# Altium schematic sheet Madhumathimmiv_8-bit-breadboard-computer-modules__schematic_Register__register.schdoc
size 304 x 180 mm
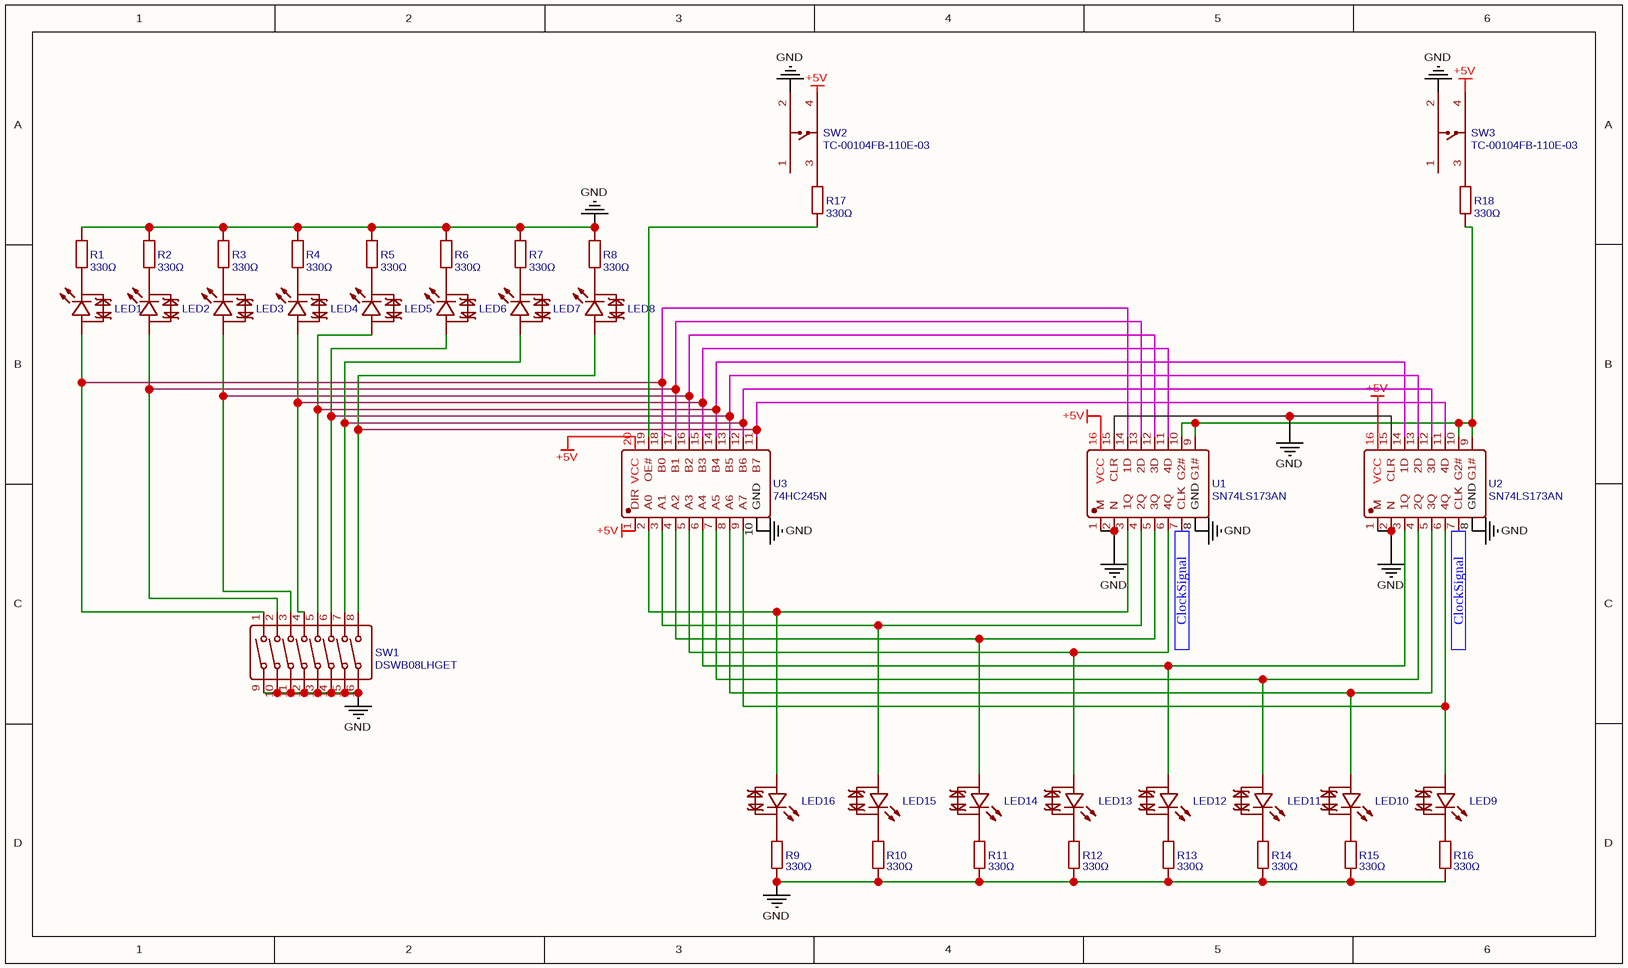
[diagram p0: Madhumathimmiv_8-bit-breadboard-computer-modules__schematic_Register__register.schdoc]

## Parts
LED1  204-15UTC/S400-X9-L  [LED-TH_BD3.0-P2.54-FD]  (value not drawn)
LED2  204-15UTC/S400-X9-L  [LED-TH_BD3.0-P2.54-FD]  (value not drawn)
LED3  204-15UTC/S400-X9-L  [LED-TH_BD3.0-P2.54-FD]  (value not drawn)
LED4  204-15UTC/S400-X9-L  [LED-TH_BD3.0-P2.54-FD]  (value not drawn)
LED5  204-15UTC/S400-X9-L  [LED-TH_BD3.0-P2.54-FD]  (value not drawn)
LED6  204-15UTC/S400-X9-L  [LED-TH_BD3.0-P2.54-FD]  (value not drawn)
LED7  204-15UTC/S400-X9-L  [LED-TH_BD3.0-P2.54-FD]  (value not drawn)
LED8  204-15UTC/S400-X9-L  [LED-TH_BD3.0-P2.54-FD]  (value not drawn)
LED9  204-15UTC/S400-X9-L  [LED-TH_BD3.0-P2.54-FD]  (value not drawn)
LED10  204-15UTC/S400-X9-L  [LED-TH_BD3.0-P2.54-FD]  (value not drawn)
LED11  204-15UTC/S400-X9-L  [LED-TH_BD3.0-P2.54-FD]  (value not drawn)
LED12  204-15UTC/S400-X9-L  [LED-TH_BD3.0-P2.54-FD]  (value not drawn)
LED13  204-15UTC/S400-X9-L  [LED-TH_BD3.0-P2.54-FD]  (value not drawn)
LED14  204-15UTC/S400-X9-L  [LED-TH_BD3.0-P2.54-FD]  (value not drawn)
LED15  204-15UTC/S400-X9-L  [LED-TH_BD3.0-P2.54-FD]  (value not drawn)
LED16  204-15UTC/S400-X9-L  [LED-TH_BD3.0-P2.54-FD]  (value not drawn)
R1  330Ω  [RES-TH_BD3.3-L9.0-P13.00-D0.6]
R2  330Ω  [RES-TH_BD3.3-L9.0-P13.00-D0.6]
R3  330Ω  [RES-TH_BD3.3-L9.0-P13.00-D0.6]
R4  330Ω  [RES-TH_BD3.3-L9.0-P13.00-D0.6]
R5  330Ω  [RES-TH_BD3.3-L9.0-P13.00-D0.6]
R6  330Ω  [RES-TH_BD3.3-L9.0-P13.00-D0.6]
R7  330Ω  [RES-TH_BD3.3-L9.0-P13.00-D0.6]
R8  330Ω  [RES-TH_BD3.3-L9.0-P13.00-D0.6]
R9  330Ω  [RES-TH_BD3.3-L9.0-P13.00-D0.6]
R10  330Ω  [RES-TH_BD3.3-L9.0-P13.00-D0.6]
R11  330Ω  [RES-TH_BD3.3-L9.0-P13.00-D0.6]
R12  330Ω  [RES-TH_BD3.3-L9.0-P13.00-D0.6]
R13  330Ω  [RES-TH_BD3.3-L9.0-P13.00-D0.6]
R14  330Ω  [RES-TH_BD3.3-L9.0-P13.00-D0.6]
R15  330Ω  [RES-TH_BD3.3-L9.0-P13.00-D0.6]
R16  330Ω  [RES-TH_BD3.3-L9.0-P13.00-D0.6]
R17  330Ω  [RES-TH_BD3.3-L9.0-P13.00-D0.6]
R18  330Ω  [RES-TH_BD3.3-L9.0-P13.00-D0.6]
SW1  DSWB08LHGET  [SW-TH_DSWB08LHGET]
SW2  TC-00104FB-110E-03  [SW-TH_4P-L6.0-W6.0-P4.50-LS6.5]
SW3  TC-00104FB-110E-03  [SW-TH_4P-L6.0-W6.0-P4.50-LS6.5]
U1  SN74LS173AN  [PDIP-16_L19.3-W6.4-P2.54-LS7.94-BL]
U2  SN74LS173AN  [PDIP-16_L19.3-W6.4-P2.54-LS7.94-BL]
U3  74HC245N  [DIP-20_L26.8-W6.4-P2.54-LS7.6-BL]

## Ports
ClockSignal (in)

## Nets
+5V: SW3.4 U1.16(VCC) U2.16(VCC) U3.1(DIR) U3.20(VCC)
GND: R1.2 R2.2 R3.2 R4.2 R5.2 R6.2 R7.2 R8.2 R9.2 R10.2 R11.2 R12.2 R13.2 R14.2 R15.2 R16.2 SW1.9 SW1.10 SW1.11 SW1.12 SW1.13 SW1.14 SW1.15 SW1.16 SW2.2 SW3.2 U1.1(M) U1.2(N) U1.8(GND) U1.15(CLR) U2.1(M) U2.2(N) U2.8(GND) U2.15(CLR) U3.10(GND)
ClockSignal: U1.7(CLK) U2.7(CLK) ; port ClockSignal
NetLED1_1: LED1.1(A) SW1.1 U1.14(1D) U3.18(B0)
NetLED1_2: LED1.2(C) R1.1
NetLED2_1: LED2.1(A) SW1.2 U1.13(2D) U3.17(B1)
NetLED2_2: LED2.2(C) R2.1
NetLED3_1: LED3.1(A) SW1.3 U1.12(3D) U3.16(B2)
NetLED3_2: LED3.2(C) R3.1
NetLED4_1: LED4.1(A) SW1.4 U1.11(4D) U3.15(B3)
NetLED4_2: LED4.2(C) R4.1
NetLED5_1: LED5.1(A) SW1.5 U2.14(1D) U3.14(B4)
NetLED5_2: LED5.2(C) R5.1
NetLED6_1: LED6.1(A) SW1.6 U2.13(2D) U3.13(B5)
NetLED6_2: LED6.2(C) R6.1
NetLED7_1: LED7.1(A) SW1.7 U2.12(3D) U3.12(B6)
NetLED7_2: LED7.2(C) R7.1
NetLED8_1: LED8.1(A) SW1.8 U2.11(4D) U3.11(B7)
NetLED8_2: LED8.2(C) R8.1
NetLED9_1: LED9.1(A) U2.6(4Q) U3.9(A7)
NetLED9_2: LED9.2(C) R16.1
NetLED10_1: LED10.1(A) U2.5(3Q) U3.8(A6)
NetLED10_2: LED10.2(C) R15.1
NetLED11_1: LED11.1(A) U2.4(2Q) U3.7(A5)
NetLED11_2: LED11.2(C) R14.1
NetLED12_1: LED12.1(A) U2.3(1Q) U3.6(A4)
NetLED12_2: LED12.2(C) R13.1
NetLED13_1: LED13.1(A) U1.6(4Q) U3.5(A3)
NetLED13_2: LED13.2(C) R12.1
NetLED14_1: LED14.1(A) U1.5(3Q) U3.4(A2)
NetLED14_2: LED14.2(C) R11.1
NetLED15_1: LED15.1(A) U1.4(2Q) U3.3(A1)
NetLED15_2: LED15.2(C) R10.1
NetLED16_1: LED16.1(A) U1.3(1Q) U3.2(A0)
NetLED16_2: LED16.2(C) R9.1
NetR17_1: R17.1 U3.19(OE#)
NetR17_2: R17.2 SW2.3
NetR18_1: R18.1 U1.9(G1#) U1.10(G2#) U2.9(G1#) U2.10(G2#)
NetR18_2: R18.2 SW3.3

Not connected (* = marked no-connect by the designer): SW2 1 4; SW3 1

## Notes on the sheet
- Labels drawn without touching a wire or pin: +5V

## Library data of the parts
LED1-LED16 = 204-15UTC/S400-X9-L: Manufacturer: EVERLIGHT(亿光); Contributor: LCSC; Supplier: LCSC; Supplier Part: C282138; Manufacturer Part: 204-15UTC/S400-X9-L; JLCPCB Part Class: Extended Part; spicePre: L; spiceSymbolName: 204-15UTC/S400-X9-L
R1-R18 = 330Ω: Manufacturer: CCO(千志电子); Manufacturer Part: MF1/2W-0.1Ω±1% T; nameAlias: Value; Contributor: LCSC; Supplier: LCSC; Supplier Part: C119393; JLCPCB Part Class: Extended Part; spicePre: R; spiceSymbolName: MF1/2W-0.1Ω±1% T52
SW1 = DSWB08LHGET: Manufacturer: YE; Contributor: LCSC; Supplier: LCSC; Supplier Part: C99413; Manufacturer Part: DSWB08LHGET; JLCPCB Part Class: Extended Part; spicePre: S; spiceSymbolName: DSWB08LHGET
SW2 SW3 = TC-00104FB-110E-03: Manufacturer: HOOYA(皓宇电子); Contributor: lcsc; Supplier: LCSC; Supplier Part: C7542981; Manufacturer Part: TC-00104FB-110E-03; JLCPCB Part Class: Extended Part; spicePre: S; spiceSymbolName: TC-00104FB-110E-03
U1 U2 = SN74LS173AN: Manufacturer: TI(德州仪器); Contributor: LCSC; Supplier: LCSC; Supplier Part: C1550125; Manufacturer Part: SN74LS173AN; JLCPCB Part Class: Extended Part; spicePre: U; spiceSymbolName: SN74LS173AN
U3 = 74HC245N: Manufacturer: HGSEMI(华冠); Contributor: LCSC; Supplier: LCSC; Supplier Part: C507182; Manufacturer Part: 74HC245N; JLCPCB Part Class: Extended Part; spicePre: U; spiceSymbolName: 74HC245N